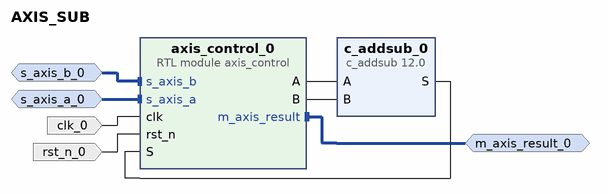
[diagram p0: block diagram of the top level]
# Vivado block design AXIS_SUB, xczu9eg-ffvb1156-2-i-es2, Vivado 2018.3
create_bd_design AXIS_SUB

create_bd_intf_port -mode Slave -vlnv xilinx.com:interface:axis_rtl:1.0 s_axis_b_0
set_property -dict [list \
  CONFIG.HAS_TKEEP 0 \
  CONFIG.HAS_TLAST 1 \
  CONFIG.HAS_TREADY 1 \
  CONFIG.HAS_TSTRB 0 \
  CONFIG.LAYERED_METADATA undef \
  CONFIG.TDATA_NUM_BYTES 4 \
  CONFIG.TDEST_WIDTH 0 \
  CONFIG.TID_WIDTH 0 \
  CONFIG.TUSER_WIDTH 0 \
] [get_bd_intf_ports s_axis_b_0]
create_bd_intf_port -mode Slave -vlnv xilinx.com:interface:axis_rtl:1.0 s_axis_a_0
set_property -dict [list \
  CONFIG.HAS_TKEEP 0 \
  CONFIG.HAS_TLAST 1 \
  CONFIG.HAS_TREADY 1 \
  CONFIG.HAS_TSTRB 0 \
  CONFIG.LAYERED_METADATA undef \
  CONFIG.TDATA_NUM_BYTES 4 \
  CONFIG.TDEST_WIDTH 0 \
  CONFIG.TID_WIDTH 0 \
  CONFIG.TUSER_WIDTH 0 \
] [get_bd_intf_ports s_axis_a_0]
create_bd_intf_port -mode Master -vlnv xilinx.com:interface:axis_rtl:1.0 m_axis_result_0
create_bd_port -dir I -type clk clk_0
create_bd_port -dir I -type rst rst_n_0

create_bd_cell -type ip -vlnv xilinx.com:ip:c_addsub:12.0 c_addsub_0
set_property -dict [list \
  CONFIG.A_Width 32 \
  CONFIG.Add_Mode Subtract \
  CONFIG.B_Value 00000000000000000000000000000000 \
  CONFIG.B_Width 32 \
  CONFIG.CE false \
  CONFIG.Implementation DSP48 \
  CONFIG.Latency 0 \
  CONFIG.Out_Width 32 \
] [get_bd_cells c_addsub_0]
create_bd_cell -type module -reference axis_control axis_control_0

# ---- connections ----

connect_bd_intf_net [get_bd_intf_ports m_axis_result_0] [get_bd_intf_pins axis_control_0/m_axis_result]
connect_bd_intf_net -intf_net s_axis_b_0_1 [get_bd_intf_ports s_axis_b_0] [get_bd_intf_pins axis_control_0/s_axis_b]
connect_bd_intf_net -intf_net s_axis_a_0_1 [get_bd_intf_ports s_axis_a_0] [get_bd_intf_pins axis_control_0/s_axis_a]
connect_bd_net [get_bd_pins axis_control_0/A] [get_bd_pins c_addsub_0/A]
connect_bd_net [get_bd_pins axis_control_0/B] [get_bd_pins c_addsub_0/B]
connect_bd_net [get_bd_pins c_addsub_0/S] [get_bd_pins axis_control_0/S]
connect_bd_net -net clk_0_1 [get_bd_ports clk_0] [get_bd_pins axis_control_0/clk]
connect_bd_net -net rst_n_0_1 [get_bd_ports rst_n_0] [get_bd_pins axis_control_0/rst_n]

validate_bd_design
save_bd_design
